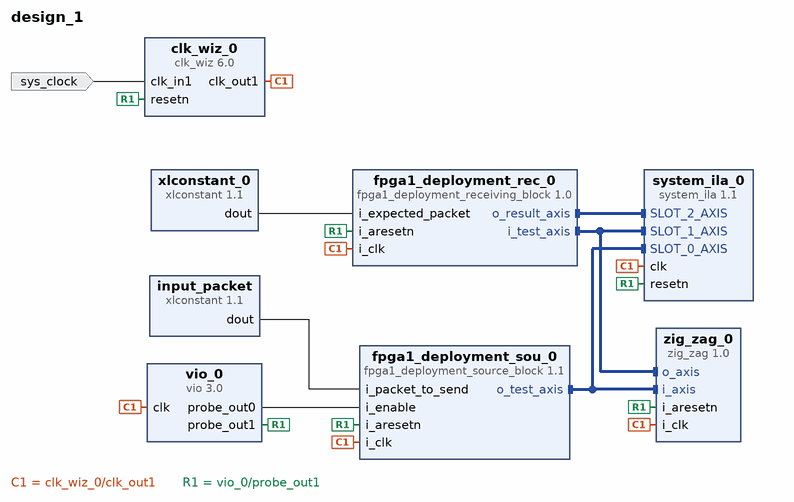
[diagram p0: block diagram of the top level]
# Vivado block design design_1, xc7a100tcsg324-1, Vivado 2018.3
create_bd_design design_1

create_bd_port -dir I -type clk sys_clock
set_property -dict {CONFIG.FREQ_HZ 100000000 CONFIG.PHASE 0.000} [get_bd_ports sys_clock]

create_bd_cell -type ip -vlnv user.org:user:fpga1_deployment_receiving_block:1.0 fpga1_deployment_rec_0
set_property -dict [list \
  CONFIG.AXIS_DATA_WIDTH 16 \
  CONFIG.NUM_BITS_PER_TRANSFER 10 \
  CONFIG.NUM_TRANSFERS 64 \
] [get_bd_cells fpga1_deployment_rec_0]
create_bd_cell -type ip -vlnv user.org:user:fpga1_deployment_source_block:1.1 fpga1_deployment_sou_0
set_property -dict [list \
  CONFIG.AXIS_DATA_WIDTH 16 \
  CONFIG.NUM_BITS_PER_TRANSFER 10 \
  CONFIG.NUM_TRANSFERS 64 \
] [get_bd_cells fpga1_deployment_sou_0]
create_bd_cell -type ip -vlnv xilinx.com:ip:clk_wiz:6.0 clk_wiz_0
set_property -dict [list \
  CONFIG.CLK_IN1_BOARD_INTERFACE sys_clock \
  CONFIG.RESET_PORT resetn \
  CONFIG.RESET_TYPE ACTIVE_LOW \
  CONFIG.USE_BOARD_FLOW true \
  CONFIG.USE_LOCKED false \
] [get_bd_cells clk_wiz_0]
create_bd_cell -type ip -vlnv xilinx.com:ip:system_ila:1.1 system_ila_0
set_property -dict [list \
  CONFIG.C_NUM_MONITOR_SLOTS 3 \
  CONFIG.C_SLOT 2 \
  CONFIG.C_SLOT_0_INTF_TYPE xilinx.com:interface:axis_rtl:1.0 \
  CONFIG.C_SLOT_1_INTF_TYPE xilinx.com:interface:axis_rtl:1.0 \
  CONFIG.C_SLOT_2_INTF_TYPE xilinx.com:interface:axis_rtl:1.0 \
] [get_bd_cells system_ila_0]
create_bd_cell -type ip -vlnv xilinx.com:ip:xlconstant:1.1 input_packet
set_property -dict [list \
  CONFIG.CONST_VAL 0b0001000000000011111100001111100000111101000011110000001110110000111010000011100100001110000000110111000011011000001101010000110100000011001100001100100000110001000011000000001011110000101110000010110100001011000000101011000010101000001010010000101000000010011100001001100000100101000010010000001000110000100010000010000100001000000000011111000001111000000111010000011100000001101100000110100000011001000001100000000101110000010110000001010100000101000000010011000001001000000100010000010000000000111100000011100000001101000000110000000010110000001010000000100100000010000000000111000000011000000001010000000100000000001100000000100000000001 \
  CONFIG.CONST_WIDTH 640 \
] [get_bd_cells input_packet]
create_bd_cell -type ip -vlnv xilinx.com:ip:vio:3.0 vio_0
set_property -dict {CONFIG.C_NUM_PROBE_IN 0 CONFIG.C_NUM_PROBE_OUT 2} [get_bd_cells vio_0]
create_bd_cell -type ip -vlnv xilinx.com:ip:xlconstant:1.1 xlconstant_0
set_property -dict [list \
  CONFIG.CONST_VAL 0b0001000000000011111100001110000000110000000011011100001111100000111101000011011000001011110000101000000010000000001001110000101110000011010100001111000000111011000011010000001011010000100110000001111100000110000000010000000001011100000111100000100101000010110000001100110000111010000011100100001100100000101011000010010000000111010000010110000000111100000010000000000111000000111000000101010000011100000010001100001010100000110001000010100100001000100000011011000001010000000011010000000110000000010100000011000000010011000001101000001000010000011001000001001000000010110000000100000000001100000010100000010001000000100100000000100000000001 \
  CONFIG.CONST_WIDTH 640 \
] [get_bd_cells xlconstant_0]
create_bd_cell -type ip -vlnv user.org:user:zig_zag:1.0 zig_zag_0

# ---- connections ----

connect_bd_intf_net [get_bd_intf_pins fpga1_deployment_sou_0/o_test_axis] [get_bd_intf_pins zig_zag_0/i_axis]
connect_bd_intf_net [get_bd_intf_pins fpga1_deployment_sou_0/o_test_axis] [get_bd_intf_pins system_ila_0/SLOT_0_AXIS]
connect_bd_intf_net -intf_net frame_destructor_cus_0_o_axis [get_bd_intf_pins fpga1_deployment_rec_0/i_test_axis] [get_bd_intf_pins zig_zag_0/o_axis]
connect_bd_intf_net [get_bd_intf_pins fpga1_deployment_rec_0/i_test_axis] [get_bd_intf_pins system_ila_0/SLOT_1_AXIS]
connect_bd_intf_net [get_bd_intf_pins fpga1_deployment_rec_0/o_result_axis] [get_bd_intf_pins system_ila_0/SLOT_2_AXIS]
connect_bd_net [get_bd_pins input_packet/dout] [get_bd_pins fpga1_deployment_sou_0/i_packet_to_send]
connect_bd_net [get_bd_pins clk_wiz_0/clk_out1] \
  [get_bd_pins vio_0/clk] [get_bd_pins fpga1_deployment_sou_0/i_clk] [get_bd_pins fpga1_deployment_rec_0/i_clk] \
  [get_bd_pins system_ila_0/clk] [get_bd_pins zig_zag_0/i_clk]
connect_bd_net [get_bd_pins vio_0/probe_out1] \
  [get_bd_pins system_ila_0/resetn] [get_bd_pins fpga1_deployment_rec_0/i_aresetn] \
  [get_bd_pins fpga1_deployment_sou_0/i_aresetn] [get_bd_pins clk_wiz_0/resetn] [get_bd_pins zig_zag_0/i_aresetn]
connect_bd_net [get_bd_pins vio_0/probe_out0] [get_bd_pins fpga1_deployment_sou_0/i_enable]
connect_bd_net [get_bd_ports sys_clock] [get_bd_pins clk_wiz_0/clk_in1]
connect_bd_net [get_bd_pins xlconstant_0/dout] [get_bd_pins fpga1_deployment_rec_0/i_expected_packet]

validate_bd_design
save_bd_design
